# Altium schematic sheet lathe_speed_controller.SchDoc
size A4; SheetNumber: 1; SheetTotal: 1
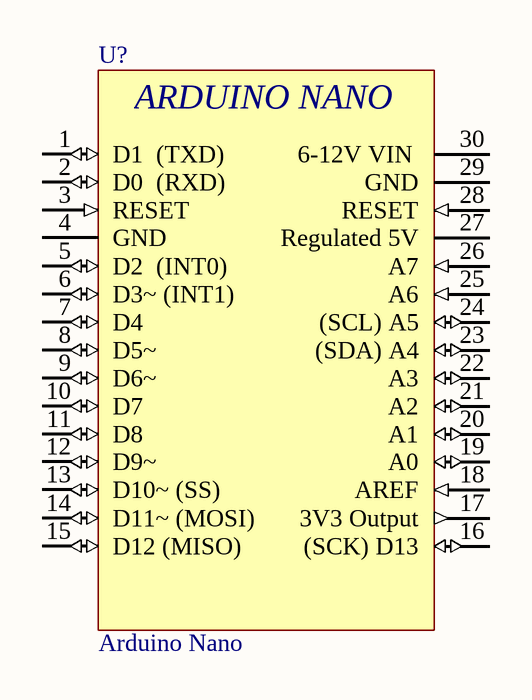
[diagram p0: lathe_speed_controller.SchDoc]

## Parts
U?  Arduino Nano  [Arduino-nano]

## Nets

Not connected (* = marked no-connect by the designer): U? 1(D1__(TXD)) 2(D0__(RXD)) 3(RESET) 4(GND) 5(D2__(INT0)) 6(D3~_(INT1)) 7(D4_) 8(D5~) 9(D6~) 10(D7) 11(D8) 12(D9~) 13(D10~_(SS)) 14(D11~_(MOSI)) 15(D12_(MISO)) 16((SCK)_D13) 17(3V3_Output) 18(AREF) 19(A0) 20(A1) 21(A2) 22(A3) 23((SDA)_A4) 24((SCL)_A5) 25(A6) 26(A7) 27(Regulated_5V) 28(RESET) 29(GND) 30(6-12V_VIN_)

## Notes on the sheet
- (in symbol Arduino Nano) ARDUINO NANO